# Altium schematic sheet CONNECTOR_A.SchDoc: =project_title
size Tabloid; CompanyName: Luxonis Holding; Organization: Luxonis Holding; Address1: 1925 Harmony Park Drive; Address2: Westminster, CO; Address3: 80234; Address4: United States; SheetNumber: 4; SheetTotal: 16
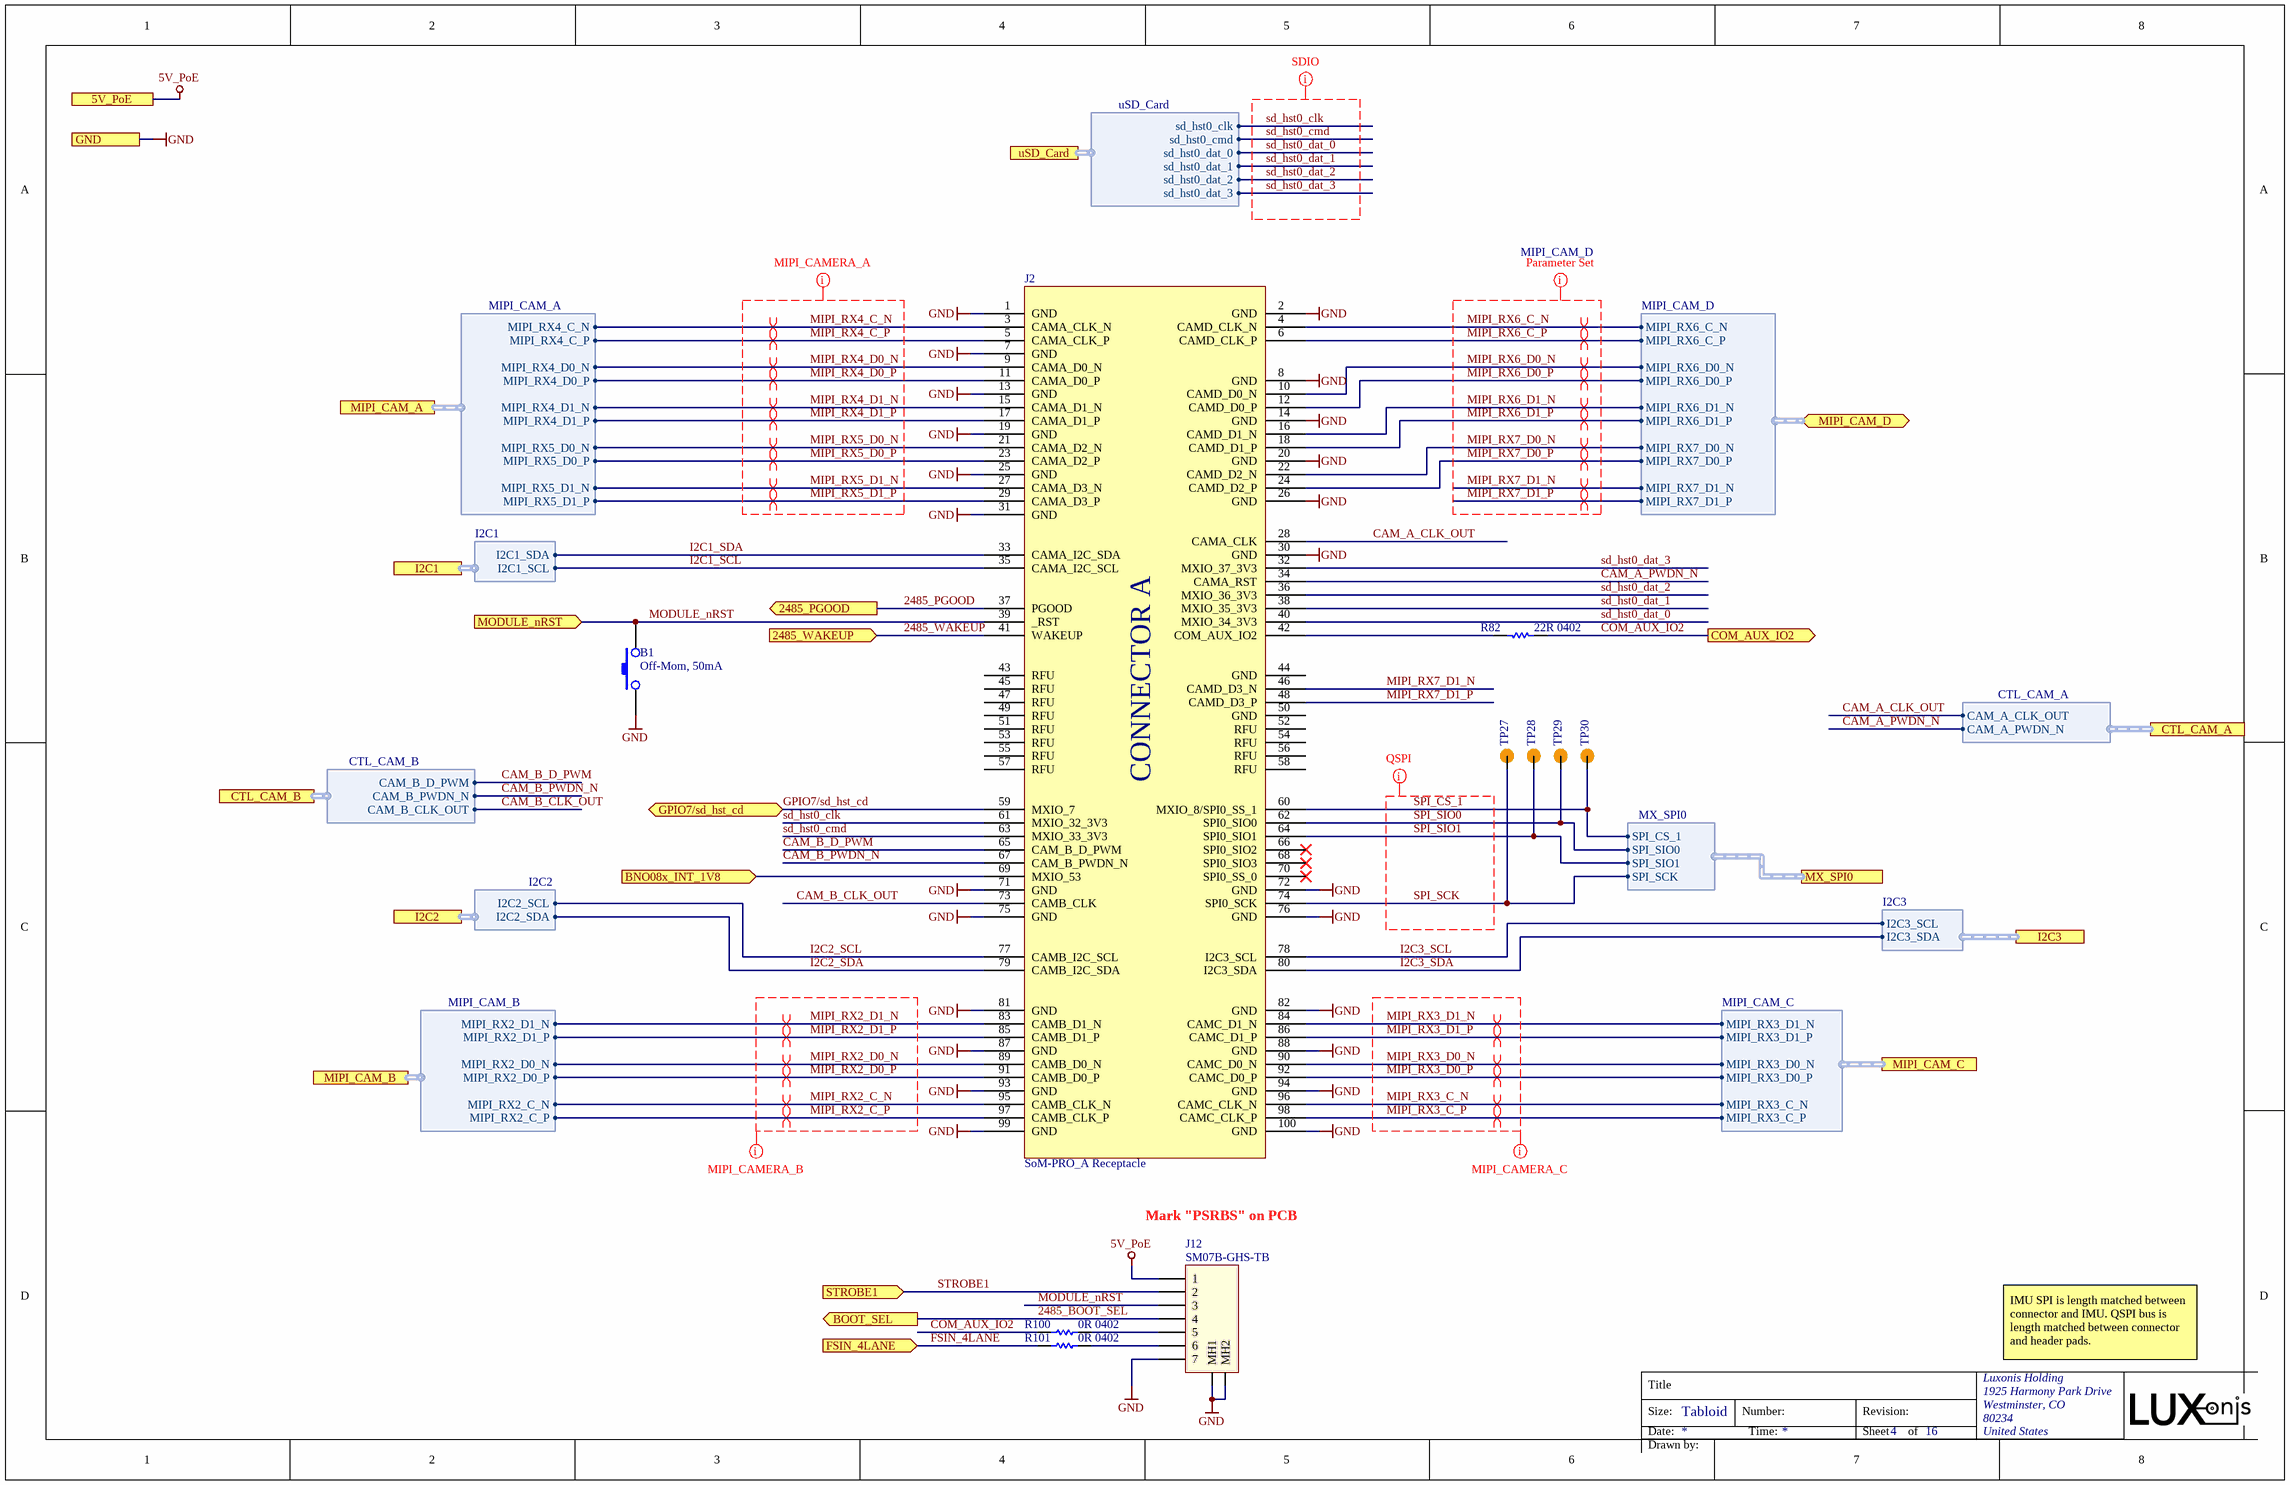
[diagram p0: CONNECTOR_A.SchDoc]

## Parts
B1  Off-Mom, 50mA  [DTSM-32N-V]
J2  SoM-PRO_A Receptacle  [CON_A_BW2099_SoM_DF40HC-3.0-100DS-0.4V_minpad]
J12  SM07B-GHS-TB  [SM07B-GHS-TB]
R82  22R 0402  [RESC0402(1005)_L]
R100  0R 0402  [RESC0402(1005)_L]
R101  0R 0402  [RESC0402(1005)_L]
TP27  TP100_200_NS  [TP100_200_NS]  (value not drawn)  (no BOM)
TP28  TP100_200_NS  [TP100_200_NS]  (value not drawn)  (no BOM)
TP29  TP100_200_NS  [TP100_200_NS]  (value not drawn)  (no BOM)
TP30  TP100_200_NS  [TP100_200_NS]  (value not drawn)  (no BOM)

## Ports
5V_PoE, 2485_PGOOD (out), 2485_WAKEUP (in), BNO08x_INT_1V8 (in), BOOT_SEL (out), COM_AUX_IO2 (out), CTL_CAM_A (harness CTL_CAM_A), CTL_CAM_B (harness CTL_CAM_B), FSIN_4LANE (in), GND, GPIO7/sd_hst_cd (bidir), I2C1 (harness I2C1), I2C2 (harness I2C2), I2C3 (harness I2C3), MIPI_CAM_A (harness MIPI_CAM_A), MIPI_CAM_B (harness MIPI_CAM_B), MIPI_CAM_C (harness MIPI_CAM_C), MIPI_CAM_D (bidir, harness MIPI_CAM_D), MODULE_nRST (in), MX_SPI0 (harness MX_SPI0), STROBE1 (in), uSD_Card (harness uSD_Card)

## Harnesses
MIPI_CAM_B: MIPI_RX2_C_P, MIPI_RX2_C_N, MIPI_RX2_D0_P, MIPI_RX2_D0_N, MIPI_RX2_D1_P, MIPI_RX2_D1_N
MIPI_CAM_A: MIPI_RX4_C_N, MIPI_RX4_C_P, MIPI_RX4_D0_N, MIPI_RX4_D0_P, MIPI_RX4_D1_N, MIPI_RX4_D1_P, MIPI_RX5_D0_N, MIPI_RX5_D0_P, MIPI_RX5_D1_N, MIPI_RX5_D1_P
MIPI_CAM_C: MIPI_RX3_C_P, MIPI_RX3_C_N, MIPI_RX3_D0_P, MIPI_RX3_D0_N, MIPI_RX3_D1_P, MIPI_RX3_D1_N
I2C2: I2C2_SDA, I2C2_SCL
I2C1: I2C1_SDA, I2C1_SCL
CTL_CAM_B: CAM_B_PWDN_N, CAM_B_D_PWM, CAM_B_CLK_OUT
I2C3: I2C3_SDA, I2C3_SCL
CTL_CAM_A: CAM_A_PWDN_N, CAM_A_CLK_OUT
uSD_Card: sd_hst0_clk, sd_hst0_cmd, sd_hst0_dat_0, sd_hst0_dat_1, sd_hst0_dat_2, sd_hst0_dat_3
MX_SPI0: SPI_SIO0, SPI_SIO1, SPI_CS_1, SPI_SCK
MIPI_CAM_D: MIPI_RX6_C_N, MIPI_RX6_C_P, MIPI_RX6_D0_N, MIPI_RX6_D0_P, MIPI_RX6_D1_N, MIPI_RX6_D1_P, MIPI_RX7_D0_N, MIPI_RX7_D0_P, MIPI_RX7_D1_N, MIPI_RX7_D1_P

## Nets
5V_PoE: J12.1 ; port 5V_PoE
GND: B1.1 J2.1(GND) J2.2(GND) J2.7(GND) J2.8(GND) J2.13(GND) J2.14(GND) J2.19(GND) J2.20(GND) J2.25(GND) J2.26(GND) J2.30(GND) J2.31(GND) J2.71(GND) J2.72(GND) J2.75(GND) J2.76(GND) J2.81(GND) J2.82(GND) J2.87(GND) J2.88(GND) J2.93(GND) J2.94(GND) J2.99(GND) J2.100(GND) J12.7 J12.MH1 J12.MH2 ; port GND
2485_BOOT_SEL: J12.4 ; port BOOT_SEL
2485_PGOOD: J2.37(PGOOD) ; port 2485_PGOOD
2485_WAKEUP: J2.41(WAKEUP) ; port 2485_WAKEUP
BNO08x_INT_1V8: J2.69(MXIO_53) ; port BNO08x_INT_1V8
CAM_A_CLK_OUT: J2.28(CAMA_CLK) ; port CTL_CAM_A.CAM_A_CLK_OUT
CAM_A_PWDN_N: J2.34(CAMA_RST) ; port CTL_CAM_A.CAM_A_PWDN_N
CAM_B_CLK_OUT: J2.73(CAMB_CLK) ; port CTL_CAM_B.CAM_B_CLK_OUT
CAM_B_D_PWM: J2.65(CAM_B_D_PWM) ; port CTL_CAM_B.CAM_B_D_PWM
CAM_B_PWDN_N: J2.67(CAM_B_PWDN_N) ; port CTL_CAM_B.CAM_B_PWDN_N
COM_AUX_IO2: R82.1 R100.1 ; port COM_AUX_IO2
FSIN_4LANE: R101.1 ; port FSIN_4LANE
GPIO7/sd_hst_cd: J2.59(MXIO_7) ; port GPIO7/sd_hst_cd
I2C1_SCL: J2.35(CAMA_I2C_SCL) ; port I2C1.I2C1_SCL
I2C1_SDA: J2.33(CAMA_I2C_SDA) ; port I2C1.I2C1_SDA
I2C2_SCL: J2.77(CAMB_I2C_SCL) ; port I2C2.I2C2_SCL
I2C2_SDA: J2.79(CAMB_I2C_SDA) ; port I2C2.I2C2_SDA
I2C3_SCL: J2.78(I2C3_SCL) ; port I2C3.I2C3_SCL
I2C3_SDA: J2.80(I2C3_SDA) ; port I2C3.I2C3_SDA
MIPI_RX2_C_N: J2.95(CAMB_CLK_N) ; port MIPI_CAM_B.MIPI_RX2_C_N
MIPI_RX2_C_P: J2.97(CAMB_CLK_P) ; port MIPI_CAM_B.MIPI_RX2_C_P
MIPI_RX2_D0_N: J2.89(CAMB_D0_N) ; port MIPI_CAM_B.MIPI_RX2_D0_N
MIPI_RX2_D0_P: J2.91(CAMB_D0_P) ; port MIPI_CAM_B.MIPI_RX2_D0_P
MIPI_RX2_D1_N: J2.83(CAMB_D1_N) ; port MIPI_CAM_B.MIPI_RX2_D1_N
MIPI_RX2_D1_P: J2.85(CAMB_D1_P) ; port MIPI_CAM_B.MIPI_RX2_D1_P
MIPI_RX3_C_N: J2.96(CAMC_CLK_N) ; port MIPI_CAM_C.MIPI_RX3_C_N
MIPI_RX3_C_P: J2.98(CAMC_CLK_P) ; port MIPI_CAM_C.MIPI_RX3_C_P
MIPI_RX3_D0_N: J2.90(CAMC_D0_N) ; port MIPI_CAM_C.MIPI_RX3_D0_N
MIPI_RX3_D0_P: J2.92(CAMC_D0_P) ; port MIPI_CAM_C.MIPI_RX3_D0_P
MIPI_RX3_D1_N: J2.84(CAMC_D1_N) ; port MIPI_CAM_C.MIPI_RX3_D1_N
MIPI_RX3_D1_P: J2.86(CAMC_D1_P) ; port MIPI_CAM_C.MIPI_RX3_D1_P
MIPI_RX4_C_N: J2.3(CAMA_CLK_N) ; port MIPI_CAM_A.MIPI_RX4_C_N
MIPI_RX4_C_P: J2.5(CAMA_CLK_P) ; port MIPI_CAM_A.MIPI_RX4_C_P
MIPI_RX4_D0_N: J2.9(CAMA_D0_N) ; port MIPI_CAM_A.MIPI_RX4_D0_N
MIPI_RX4_D0_P: J2.11(CAMA_D0_P) ; port MIPI_CAM_A.MIPI_RX4_D0_P
MIPI_RX4_D1_N: J2.15(CAMA_D1_N) ; port MIPI_CAM_A.MIPI_RX4_D1_N
MIPI_RX4_D1_P: J2.17(CAMA_D1_P) ; port MIPI_CAM_A.MIPI_RX4_D1_P
MIPI_RX5_D0_N: J2.21(CAMA_D2_N) ; port MIPI_CAM_A.MIPI_RX5_D0_N
MIPI_RX5_D0_P: J2.23(CAMA_D2_P) ; port MIPI_CAM_A.MIPI_RX5_D0_P
MIPI_RX5_D1_N: J2.27(CAMA_D3_N) ; port MIPI_CAM_A.MIPI_RX5_D1_N
MIPI_RX5_D1_P: J2.29(CAMA_D3_P) ; port MIPI_CAM_A.MIPI_RX5_D1_P
MIPI_RX6_C_N: J2.4(CAMD_CLK_N) ; port MIPI_CAM_D.MIPI_RX6_C_N
MIPI_RX6_C_P: J2.6(CAMD_CLK_P) ; port MIPI_CAM_D.MIPI_RX6_C_P
MIPI_RX6_D0_N: J2.10(CAMD_D0_N) ; port MIPI_CAM_D.MIPI_RX6_D0_N
MIPI_RX6_D0_P: J2.12(CAMD_D0_P) ; port MIPI_CAM_D.MIPI_RX6_D0_P
MIPI_RX6_D1_N: J2.16(CAMD_D1_N) ; port MIPI_CAM_D.MIPI_RX6_D1_N
MIPI_RX6_D1_P: J2.18(CAMD_D1_P) ; port MIPI_CAM_D.MIPI_RX6_D1_P
MIPI_RX7_D0_N: J2.22(CAMD_D2_N) ; port MIPI_CAM_D.MIPI_RX7_D0_N
MIPI_RX7_D0_P: J2.24(CAMD_D2_P) ; port MIPI_CAM_D.MIPI_RX7_D0_P
MIPI_RX7_D1_N: J2.46(CAMD_D3_N) ; port MIPI_CAM_D.MIPI_RX7_D1_N
MIPI_RX7_D1_P: J2.48(CAMD_D3_P) ; port MIPI_CAM_D.MIPI_RX7_D1_P
MODULE_nRST: B1.2 J2.39(_RST) J12.3 ; port MODULE_nRST
sd_hst0_clk: J2.61(MXIO_32_3V3) ; port uSD_Card.sd_hst0_clk
sd_hst0_cmd: J2.63(MXIO_33_3V3) ; port uSD_Card.sd_hst0_cmd
sd_hst0_dat_0: J2.40(MXIO_34_3V3) ; port uSD_Card.sd_hst0_dat_0
sd_hst0_dat_1: J2.38(MXIO_35_3V3) ; port uSD_Card.sd_hst0_dat_1
sd_hst0_dat_2: J2.36(MXIO_36_3V3) ; port uSD_Card.sd_hst0_dat_2
sd_hst0_dat_3: J2.32(MXIO_37_3V3) ; port uSD_Card.sd_hst0_dat_3
SPI_CS_1: J2.60(MXIO_8/SPI0_SS_1) TP30.1 ; port MX_SPI0.SPI_CS_1
SPI_SCK: J2.74(SPI0_SCK) TP27.1 ; port MX_SPI0.SPI_SCK
SPI_SIO0: J2.62(SPI0_SIO0) TP29.1 ; port MX_SPI0.SPI_SIO0
SPI_SIO1: J2.64(SPI0_SIO1) TP28.1 ; port MX_SPI0.SPI_SIO1
STROBE1: J12.2 ; port STROBE1
NetJ2_42: J2.42(COM_AUX_IO2) R82.2
NetJ12_5: J12.5 R100.2
NetJ12_6: J12.6 R101.2

Not connected (* = marked no-connect by the designer): J2 43(RFU) 44(GND) 45(RFU) 47(RFU) 49(RFU) 50(GND) 51(RFU) 52(RFU) 53(RFU) 54(RFU) 55(RFU) 56(RFU) 57(RFU) 58(RFU) 66(SPI0_SIO2)* 68(SPI0_SIO3)* 70(SPI0_SS_0)*

## Layout directives
differential pair; differential pair class 100ohm: MIPI_RX2_C_N, MIPI_RX2_C_P, MIPI_RX2_D0_N, MIPI_RX2_D0_P, MIPI_RX2_D1_N, MIPI_RX2_D1_P, MIPI_RX3_C_N, MIPI_RX3_C_P, MIPI_RX3_D0_N, MIPI_RX3_D0_P, MIPI_RX3_D1_N, MIPI_RX3_D1_P, MIPI_RX4_C_N, MIPI_RX4_C_P, MIPI_RX4_D0_N, MIPI_RX4_D0_P, MIPI_RX4_D1_N, MIPI_RX4_D1_P, MIPI_RX5_D0_N, MIPI_RX5_D0_P, MIPI_RX5_D1_N, MIPI_RX5_D1_P, MIPI_RX6_C_N, MIPI_RX6_C_P, MIPI_RX6_D0_N, MIPI_RX6_D0_P, MIPI_RX6_D1_N, MIPI_RX6_D1_P, MIPI_RX7_D0_N, MIPI_RX7_D0_P, MIPI_RX7_D1_N, MIPI_RX7_D1_P
net class MIPI_CAM_A: MIPI_RX4_C_N, MIPI_RX4_C_P, MIPI_RX4_D0_N, MIPI_RX4_D0_P, MIPI_RX4_D1_N, MIPI_RX4_D1_P, MIPI_RX5_D0_N, MIPI_RX5_D0_P, MIPI_RX5_D1_N, MIPI_RX5_D1_P
net class MIPI_CAM_C: MIPI_RX3_C_N, MIPI_RX3_C_P, MIPI_RX3_D0_N, MIPI_RX3_D0_P, MIPI_RX3_D1_N, MIPI_RX3_D1_P
net class MIPI_CAM_B: MIPI_RX2_C_N, MIPI_RX2_C_P, MIPI_RX2_D0_N, MIPI_RX2_D0_P, MIPI_RX2_D1_N, MIPI_RX2_D1_P
net class QSPI: SPI_CS_1, SPI_SCK, SPI_SIO0, SPI_SIO1
net class SDIO: sd_hst0_clk, sd_hst0_cmd, sd_hst0_dat_0, sd_hst0_dat_1, sd_hst0_dat_2, sd_hst0_dat_3
net class MIPI_CAM_D; rule Matched Net Lengths [Delay Tolerance = 1ps]; rule Matched Net Lengths [Delay Tolerance = 0,5ps]: MIPI_RX6_C_N, MIPI_RX6_C_P, MIPI_RX6_D0_N, MIPI_RX6_D0_P, MIPI_RX6_D1_N, MIPI_RX6_D1_P, MIPI_RX7_D0_N, MIPI_RX7_D0_P, MIPI_RX7_D1_N, MIPI_RX7_D1_P

## Notes on the sheet
- Mark "PSRBS" on PCB
- IMU SPI is length matched between connector and IMU. QSPI bus is length matched between connector and header pads.
- Title
- Size:
- Date:
- Tabloid
- Number:
- Time:
- Revision:
- Sheet
- of
- Drawn by:
- (in symbol DF40HC(3.0)-100DS-0.4V_SoM-PRO_A) CONNECTOR A

## Library data of the parts
B1 = DTSM-32N-V: SWITCH TACTILE SMT 3.5mm * 6mm , brown 160gf; Manufacturer 1: Diptronics; Manufacturer Part Number 1: DTSM-32N-V-T/R; Supplier 1: Mouser; Stock 1: 3199; Pricing 1: 1=0.38000, 10=0.38000, 50=0.31000, 100=0.28200, 500=0.25600, 1000=0.23600, 1600=0.20900, 4800=0.18800, 9600=0.17300, 10000=0.17300, 24000=0.16100 (USD); RoHS: No; Min Operating Temperature: -30°C; Max Operating Temperature: 80°C; Length: 6mm; Height: 5mm; Width: 3.5mm; ComponentLink1URL: https://datasheet.ciiva.com/29188/708548-da-01-en-tastschalter-smd-dtsm-32n-v-tr-1600st-29188823.pdf?src-supplier=Conrad; ComponentLink1Description: https://datasheet.ciiva.com/29188/708548-da-01-en-tastschalter-smd-dtsm-32n-v-tr-1600st-29188823.pdf?src-supplier=Conrad; Supplier Part Number 1: 113-DTSM32NVTR
J2 = DF40HC(3.0)-100DS-0.4V_SoM-PRO_A: CONN RCPT 100POS 0.4MM SMD GOLD; Manufacturer 1: Hirose; Manufacturer Part Number 1: DF40HC(3.0)-100DS-0.4V(58); Number of Positions: 100; Pitch: 0.016inch; System: Connector; RoHS: Yes; Mount: Surface Mount; Contact Plating: Gold; Packaging: Tape and Reel; Number of Rows: 2; Package Quantity: 1000; Connector Type: Receptacle; Lead Free: Lead Free; ComponentLink1URL: https://datasheet.ciiva.com/46636/ed-df40-20140305-46636517.pdf?src-supplier=Digi-Key; ComponentLink1Description: https://datasheet.ciiva.com/46636/ed-df40-20140305-46636517.pdf?src-supplier=Digi-Key; ComponentLink2URL: https://datasheet.ciiva.com/18562/ed-df40-20140305-18562189.pdf?src-supplier=Digi-Key; ComponentLink2Description: https://datasheet.ciiva.com/18562/ed-df40-20140305-18562189.pdf?src-supplier=Digi-Key; ComponentLink3URL: https://datasheet.ciiva.com/13559/ed-df40-20140305-13559540.pdf?src-supplier=Mouser; ComponentLink3Description: https://datasheet.ciiva.com/13559/ed-df40-20140305-13559540.pdf?src-supplier=Mouser; ComponentLink4URL: https://datasheet.ciiva.com/18562/ed-df40-20140305-18562462.pdf?src-supplier=Digi-Key; ComponentLink4Description: https://datasheet.ciiva.com/18562/ed-df40-20140305-18562462.pdf?src-supplier=Digi-Key; Supplier 1: Mouser; Stock 1: 2172; Pricing 1: 1=2.54000, 10=2.26000, 25=2.07000, 50=2.07000, 100=1.98000, 250=1.79000, 500=1.65000, 1000=1.41000, 3000=1.32000, 6000=1.23000, 10000=1.23000 (USD); Supplier 2: Mouser; Stock 2: 2078; Pricing 2: 1=2.50000, 10=2.40000, 25=2.10000, 50=2.10000, 100=2.00000, 250=1.76000, 500=1.71000, 1000=1.45000, 2000=1.36000, 5000=1.31000, 10000=1.31000 (USD); Supplier Part Number 1: 798-DF40HC30100DS451; Supplier Part Number 2: 798-DF40HC30100DS458
J12 = SM07B-GHS-TB(LF)(SN): Conn Shrouded Header HDR 7 POS 1.25mm Solder RA Side Entry SMD T/R; Manufacturer 1: JST; Connector Type: Outer Shroud Contact; Current Rating: 1A; Voltage Rating (AC): 50V; Number of Positions: 7; Wire/Cable Gauge: 26AWG; Pitch: 0.049inch; Supplier 1: Digi-Key; Manufacturer Part Number 1: SM07B-GHS-TB(LF)(SN); RoHS: Yes; Category: Headers and Wire Housings; Stock 1: 13; Pricing 1: 1=0.55000, 10=0.51400, 100=0.39440, 500=0.34298, 1000=0.28295 (USD); Mount: Surface Mount; Color: Natural; Contact Plating: Tin; Contact Material: Bronze; Housing Material: Nylon; Housing Color: Natural; Min Operating Temperature: -25°C; Max Operating Temperature: 85°C; Number of Rows: 1; Fastening Type: Ramp; Packaging: Cut Tape; Termination: Solder; Number of Contacts: 7; REACH SVHC: Unknown; Lead Free: Lead Free; ComponentLink1URL: https://datasheet.ciiva.com/712/egh-712501.pdf?src-supplier=Digi-Key; ComponentLink1Description: https://datasheet.ciiva.com/712/egh-712501.pdf?src-supplier=Digi-Key; ComponentLink2URL: https://datasheet.ciiva.com/730/egh-730606.pdf?src-supplier=Digi-Key; ComponentLink2Description: https://datasheet.ciiva.com/730/egh-730606.pdf?src-supplier=Digi-Key; ComponentLink3URL: https://datasheet.ciiva.com/22728/5438-22728669.pdf?src-supplier=Element14; ComponentLink3Description: https://datasheet.ciiva.com/22728/5438-22728669.pdf?src-supplier=Element14
R82 = RC0402FR-0722RL: RES SMD 22 OHM 1% 1/16W 0402; Manufacturer 1: Yageo; Temperature Coefficient: 100ppm/°C; Power Rating: 63mW; Voltage Rating: 50V; Supplier 1: Digi-Key; Manufacturer Part Number 1: RC0402FR-0722RL; Stock 1: 23751364; Pricing 1: 10000=0.00163, 30000=0.00144, 50000=0.00132, 100000=0.00129 (USD); RoHS: Yes; Case/Package: 0402; Number of Pins: 2; Case Code (Metric): 1005; Case Code (Imperial): 0402; Min Operating Temperature: -55°C; Max Operating Temperature: 155°C; Tolerance: 1%; Resistance: 22R; Packaging: Tape and Reel; Composition: Thick Film; Voltage Rating (DC): 50V; Termination: SMD/SMT; Military Standard: Not; Length: 1mm; Height: 0.32mm; Width: 0.5mm; Depth: 0.5mm; REACH SVHC: Unknown; Lead Free: Lead Free; ComponentLink1URL: https://datasheet.ciiva.com/11819/0900766b80c66297-11819462.pdf?src-supplier=RSComponents; ComponentLink1Description: https://datasheet.ciiva.com/11819/0900766b80c66297-11819462.pdf?src-supplier=RSComponents; ComponentLink2URL: https://datasheet.ciiva.com/7849/1018594-7849911.pdf?src-supplier=Element14; ComponentLink2Description: https://datasheet.ciiva.com/7849/1018594-7849911.pdf?src-supplier=Element14; ComponentLink3URL: https://datasheet.ciiva.com/26829/getdatasheetpartid-554995-26829991.pdf?src-supplier=Verical; ComponentLink3Description: https://datasheet.ciiva.com/26829/getdatasheetpartid-554995-26829991.pdf?src-supplier=Verical; ComponentLink4URL: https://datasheet.ciiva.com/7849/1018594-7849912.pdf?src-supplier=Element14; ComponentLink4Description: https://datasheet.ciiva.com/7849/1018594-7849912.pdf?src-supplier=Element14; ComponentLink5URL: https://datasheet.ciiva.com/16930/pyu-rc0402-51-rohs-l-6-r-16930687.pdf?src-supplier=Future+Electronics; ComponentLink5Description: https://datasheet.ciiva.com/16930/pyu-rc0402-51-rohs-l-6-r-16930687.pdf?src-supplier=Future+Electronics; Supplier 2: Newark; Supplier 3: Mouser; Supplier Part Number 2: 26M6784; Supplier Part Number 3: 603-RC0402FR-0722RL; Supplier Part Number 1: 311-22.0LRTR-ND
R100 R101 = CRCW04020000Z0ED: RES SMD 0 OHM JUMPER 1/16W 0402; Manufacturer 1: Vishay; Resistance: 0mR; Power Rating: 63mW; Voltage Rating: 50V; Temperature Coefficient: 100ppm/°C; Tolerance: 5%; Supplier 1: Digi-Key; Manufacturer Part Number 1: CRCW04020000Z0ED; Stock 1: 855968; Pricing 1: 1=0.10000, 10=0.03400, 25=0.02440, 50=0.01860, 100=0.01380, 250=0.01048, 500=0.00840, 1000=0.00618, 5000=0.00443 (USD); RoHS: Yes; Mount: Surface Mount; Case/Package: 0402; Weight: 2.3E-05oz; Case Code (Imperial): 0402; Case Code (Metric): 1005; Contact Plating: Tin; Min Operating Temperature: -55°C; Max Operating Temperature: 155°C; Packaging: Tape and Reel; Composition: Thick Film; Voltage Rating (DC): 50V; Package Quantity: 1; Termination: SMD/SMT; Number of Terminations: 2; Military Standard: Not; Max Power Dissipation: 63mW; Features: Automotive AEC-Q200; Length: 1mm; Height: 0.35mm; Width: 0.5mm; Depth: 0.5mm; Radiation Hardening: No; REACH SVHC: Unknown; Lead Free: Lead Free; ComponentLink1URL: https://datasheet.ciiva.com/3255/dcrcwe3-3255944.pdf?src-supplier=Avnet; ComponentLink1Description: https://datasheet.ciiva.com/3255/dcrcwe3-3255944.pdf?src-supplier=Avnet; ComponentLink2URL: https://datasheet.ciiva.com/3255/dcrcwe3-3255945.pdf?src-supplier=Avnet; ComponentLink2Description: https://datasheet.ciiva.com/3255/dcrcwe3-3255945.pdf?src-supplier=Avnet; ComponentLink3URL: https://datasheet.ciiva.com/16881/dcrcwe3-16881413.pdf?src-supplier=Avnet+Europe; ComponentLink3Description: https://datasheet.ciiva.com/16881/dcrcwe3-16881413.pdf?src-supplier=Avnet+Europe; ComponentLink4URL: https://datasheet.ciiva.com/2461/dcrcwe3-2461962.pdf?src-supplier=Digi-Key; ComponentLink4Description: https://datasheet.ciiva.com/2461/dcrcwe3-2461962.pdf?src-supplier=Digi-Key; ComponentLink5URL: https://datasheet.ciiva.com/7841/1720486-7841802.pdf?src-supplier=Element14; ComponentLink5Description: https://datasheet.ciiva.com/7841/1720486-7841802.pdf?src-supplier=Element14; ComponentLink6URL: https://datasheet.ciiva.com/2461/dcrcwe3-2461963.pdf?src-supplier=Digi-Key; ComponentLink6Description: https://datasheet.ciiva.com/2461/dcrcwe3-2461963.pdf?src-supplier=Digi-Key; ComponentLink7URL: https://datasheet.ciiva.com/2461/dcrcwe3-2461964.pdf?src-supplier=Digi-Key; ComponentLink7Description: https://datasheet.ciiva.com/2461/dcrcwe3-2461964.pdf?src-supplier=Digi-Key; ComponentLink8URL: https://datasheet.ciiva.com/7841/1697337-7841468.pdf?src-supplier=Element14; ComponentLink8Description: https://datasheet.ciiva.com/7841/1697337-7841468.pdf?src-supplier=Element14; ComponentLink9URL: https://datasheet.ciiva.com/16761/70200976-16761309.pdf?src-supplier=Allied+Electronics; ComponentLink9Description: https://datasheet.ciiva.com/16761/70200976-16761309.pdf?src-supplier=Allied+Electronics; ComponentLink10URL: https://datasheet.ciiva.com/26311/fld-crcw-e3-data-en-26311550.pdf?src-supplier=Distrelec; ComponentLink10Description: https://datasheet.ciiva.com/26311/fld-crcw-e3-data-en-26311550.pdf?src-supplier=Distrelec; Supplier Part Number 1: 541-0.0JCT-ND
TP27-TP30 = TEST_POINT